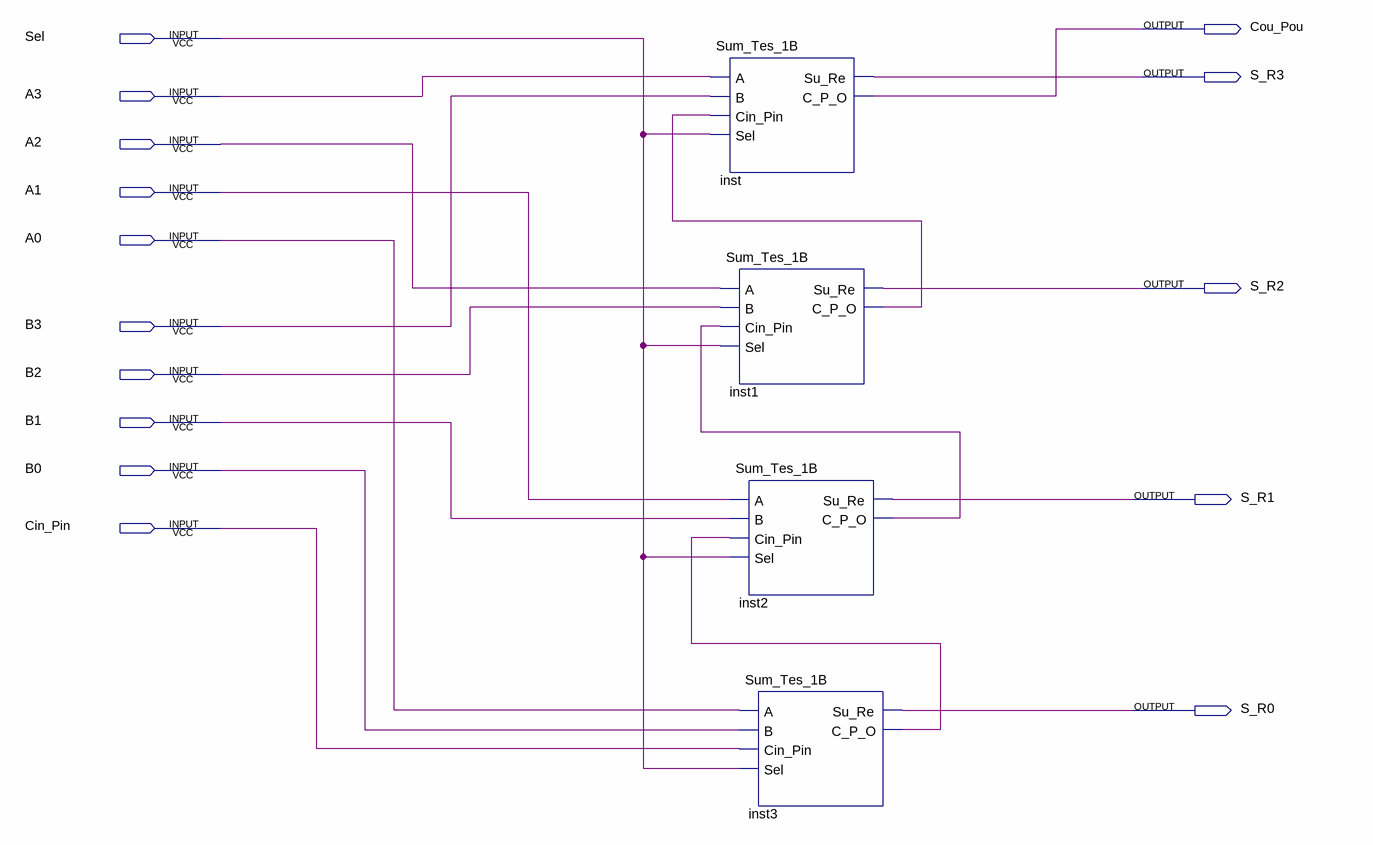
[diagram p0: schematic sheet]
// Quartus schematic Sum_Res_4B.bdf as structural Verilog: 4 symbols, 15 pins
module Sum_Res_4B (
  input  Sel,
  input  A3,
  input  A2,
  input  A1,
  input  A0,
  input  B3,
  input  B2,
  input  B1,
  input  B0,
  input  Cin_Pin,
  output Cou_Pou,
  output S_R3,
  output S_R2,
  output S_R1,
  output S_R0
);

  wire inst1_c_p_o, inst2_c_p_o, inst3_c_p_o;

  Sum_Tes_1B inst (.A(A3), .B(B3), .Cin_Pin(inst1_c_p_o), .Sel(Sel), .Su_Re(S_R3), .C_P_O(Cou_Pou));
  Sum_Tes_1B inst1 (.A(A2), .B(B2), .Cin_Pin(inst2_c_p_o), .Sel(Sel), .Su_Re(S_R2), .C_P_O(inst1_c_p_o));
  Sum_Tes_1B inst2 (.A(A1), .B(B1), .Cin_Pin(inst3_c_p_o), .Sel(Sel), .Su_Re(S_R1), .C_P_O(inst2_c_p_o));
  Sum_Tes_1B inst3 (.A(A0), .B(B0), .Cin_Pin(Cin_Pin), .Sel(Sel), .Su_Re(S_R0), .C_P_O(inst3_c_p_o));
endmodule
